# EAGLE design piezo-layer_v0.3-R001 (EAGLE 6.5.0)
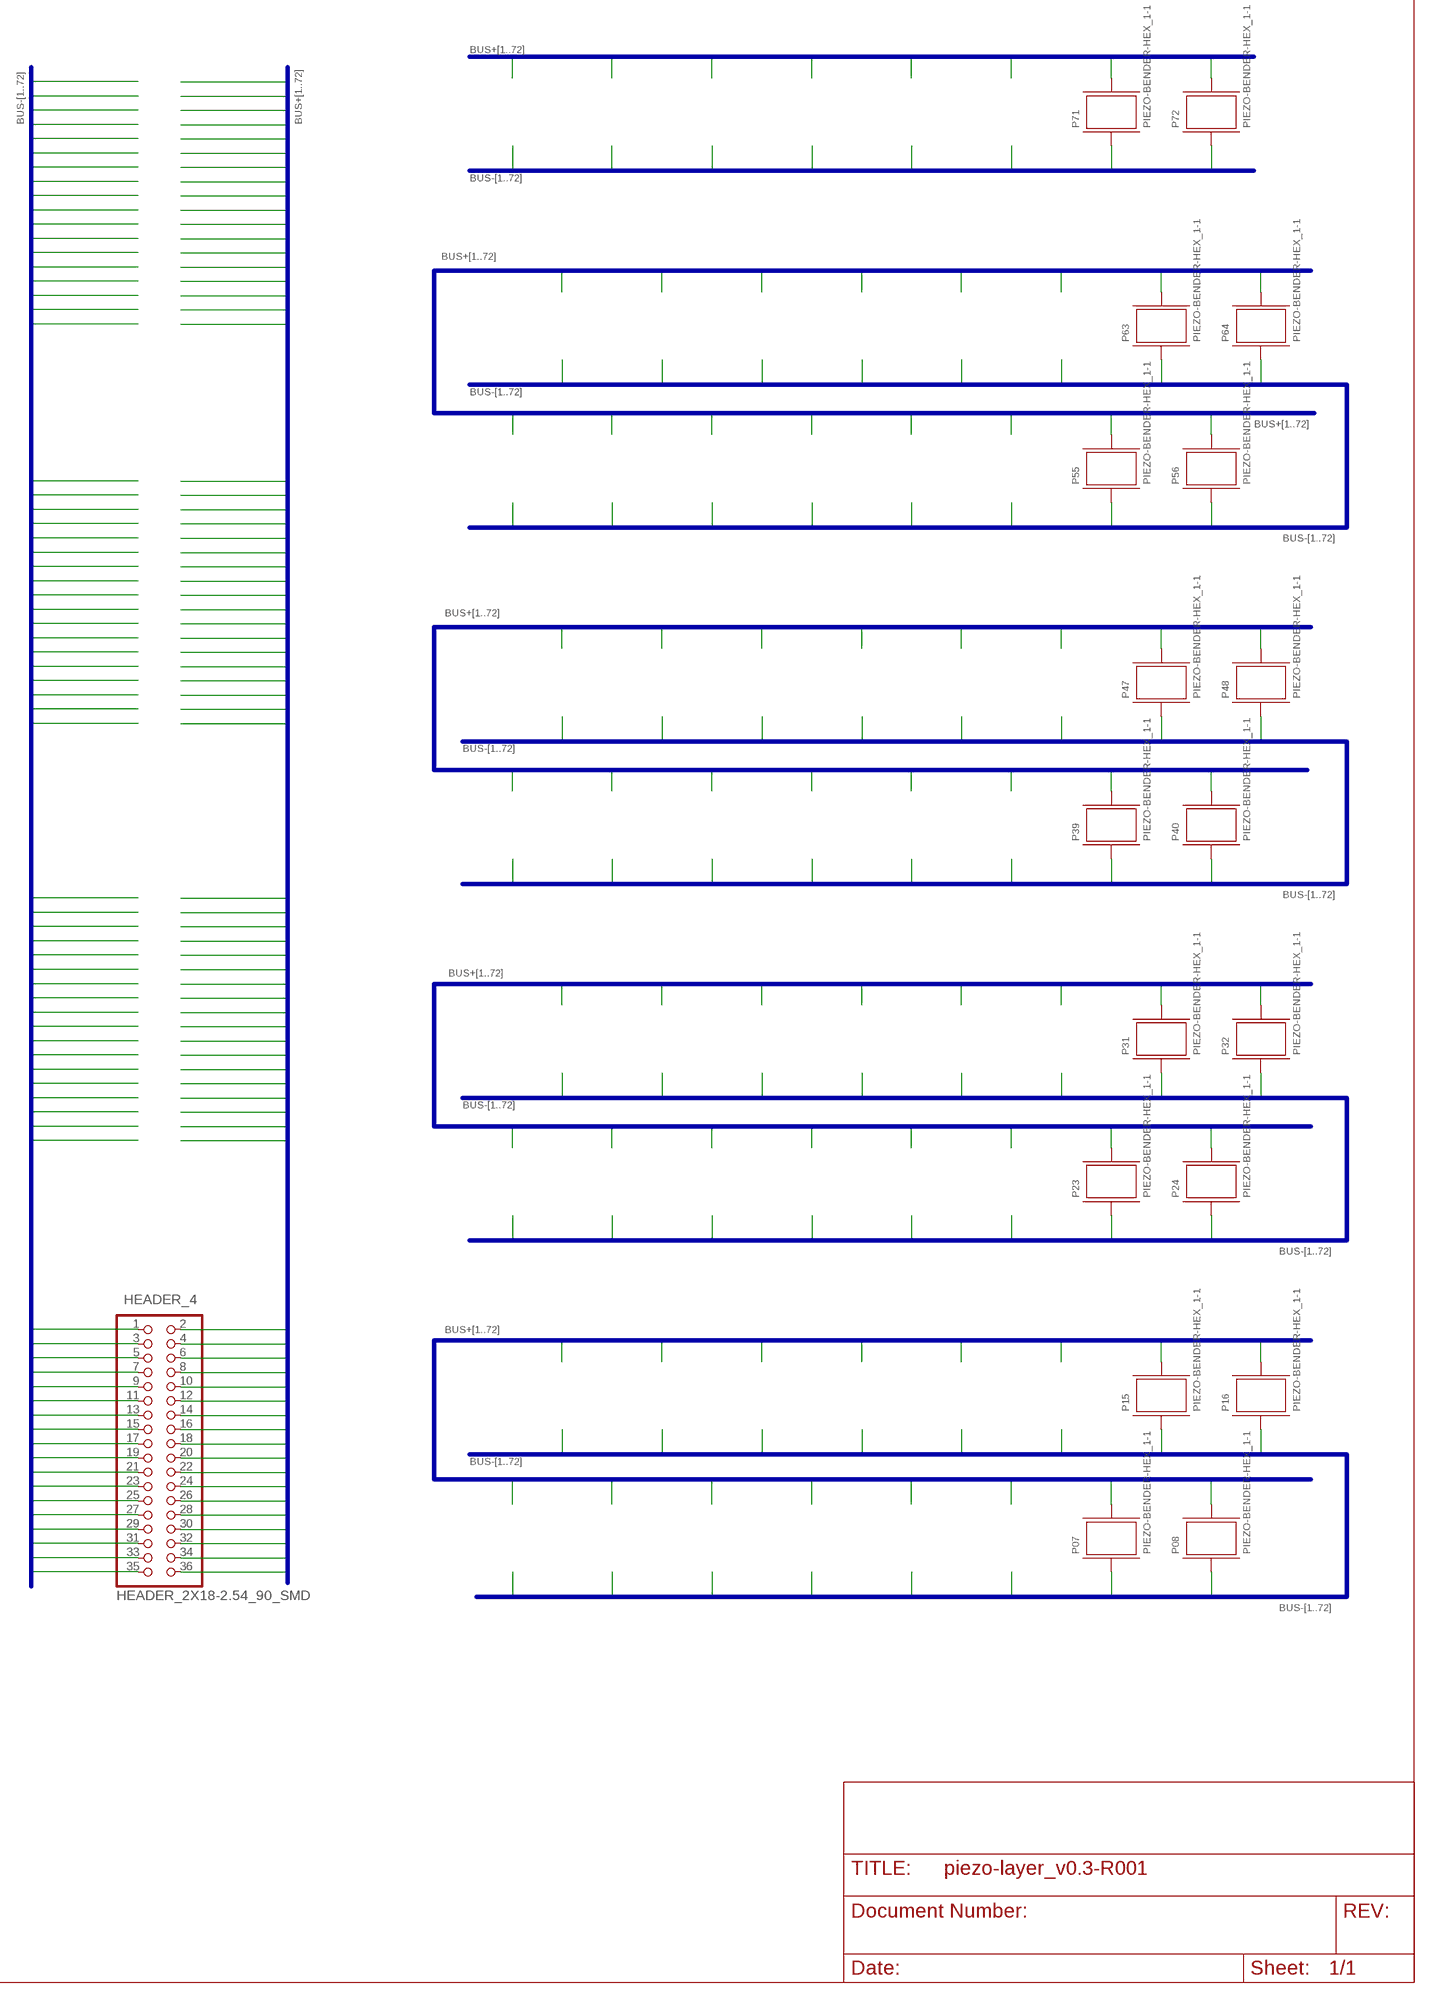
[diagram p0: schematic, sheet 1]

## Parts
HEADER_4  HEADER_2X18-2.54_90_SMD  [2X18_2.54_90_SMD]
P07  PIEZO-BENDER-HEX_1-1  [PIEZO-BENDER-HEX_16MM_1+_1-]
P08  PIEZO-BENDER-HEX_1-1  [PIEZO-BENDER-HEX_16MM_1+_1-]
P15  PIEZO-BENDER-HEX_1-1  [PIEZO-BENDER-HEX_16MM_1+_1-]
P16  PIEZO-BENDER-HEX_1-1  [PIEZO-BENDER-HEX_16MM_1+_1-]
P23  PIEZO-BENDER-HEX_1-1  [PIEZO-BENDER-HEX_16MM_1+_1-]
P24  PIEZO-BENDER-HEX_1-1  [PIEZO-BENDER-HEX_16MM_1+_1-]
P31  PIEZO-BENDER-HEX_1-1  [PIEZO-BENDER-HEX_16MM_1+_1-]
P32  PIEZO-BENDER-HEX_1-1  [PIEZO-BENDER-HEX_16MM_1+_1-]
P39  PIEZO-BENDER-HEX_1-1  [PIEZO-BENDER-HEX_16MM_1+_1-]
P40  PIEZO-BENDER-HEX_1-1  [PIEZO-BENDER-HEX_16MM_1+_1-]
P47  PIEZO-BENDER-HEX_1-1  [PIEZO-BENDER-HEX_16MM_1+_1-]
P48  PIEZO-BENDER-HEX_1-1  [PIEZO-BENDER-HEX_16MM_1+_1-]
P55  PIEZO-BENDER-HEX_1-1  [PIEZO-BENDER-HEX_16MM_1+_1-]
P56  PIEZO-BENDER-HEX_1-1  [PIEZO-BENDER-HEX_16MM_1+_1-]
P63  PIEZO-BENDER-HEX_1-1  [PIEZO-BENDER-HEX_16MM_1+_1-]
P64  PIEZO-BENDER-HEX_1-1  [PIEZO-BENDER-HEX_16MM_1+_1-]
P71  PIEZO-BENDER-HEX_1-1  [PIEZO-BENDER-HEX_16MM_1+_1-]
P72  PIEZO-BENDER-HEX_1-1  [PIEZO-BENDER-HEX_16MM_1+_1-]

## Nets
BUS+7: HEADER_4.18 P07.TIP1(+_1)
BUS+8: HEADER_4.36 P08.TIP1(+_1)
BUS+15: HEADER_4.16 P15.TIP1(+_1)
BUS+16: HEADER_4.34 P16.TIP1(+_1)
BUS+23: HEADER_4.14 P23.TIP1(+_1)
BUS+24: HEADER_4.32 P24.TIP1(+_1)
BUS+31: HEADER_4.12 P31.TIP1(+_1)
BUS+32: HEADER_4.30 P32.TIP1(+_1)
BUS+39: HEADER_4.10 P39.TIP1(+_1)
BUS+40: HEADER_4.28 P40.TIP1(+_1)
BUS+47: HEADER_4.8 P47.TIP1(+_1)
BUS+48: HEADER_4.26 P48.TIP1(+_1)
BUS+55: HEADER_4.6 P55.TIP1(+_1)
BUS+56: HEADER_4.24 P56.TIP1(+_1)
BUS+63: HEADER_4.4 P63.TIP1(+_1)
BUS+64: HEADER_4.22 P64.TIP1(+_1)
BUS+71: HEADER_4.2 P71.TIP1(+_1)
BUS+72: HEADER_4.20 P72.TIP1(+_1)
BUS-7: HEADER_4.17 P07.PAD1(-_1)
BUS-8: HEADER_4.35 P08.PAD1(-_1)
BUS-15: HEADER_4.15 P15.PAD1(-_1)
BUS-16: HEADER_4.33 P16.PAD1(-_1)
BUS-23: HEADER_4.13 P23.PAD1(-_1)
BUS-24: HEADER_4.31 P24.PAD1(-_1)
BUS-31: HEADER_4.11 P31.PAD1(-_1)
BUS-32: HEADER_4.29 P32.PAD1(-_1)
BUS-39: HEADER_4.9 P39.PAD1(-_1)
BUS-40: HEADER_4.27 P40.PAD1(-_1)
BUS-47: HEADER_4.7 P47.PAD1(-_1)
BUS-48: HEADER_4.25 P48.PAD1(-_1)
BUS-55: HEADER_4.5 P55.PAD1(-_1)
BUS-56: HEADER_4.23 P56.PAD1(-_1)
BUS-63: HEADER_4.3 P63.PAD1(-_1)
BUS-64: HEADER_4.21 P64.PAD1(-_1)
BUS-71: HEADER_4.1 P71.PAD1(-_1)
BUS-72: HEADER_4.19 P72.PAD1(-_1)

## Buses
BUS+[1..72]
BUS-[1..72]

## Library data of the parts
HEADER_4 = SABRe:HEADER_2X18
P07 P08 P15 P16 P23 P24 P31 P32 P39 P40 P47 P48 P55 P56 P63 P64 P71 P72 = ICST:PIEZO-BENDER-HEX_1-1

## Board
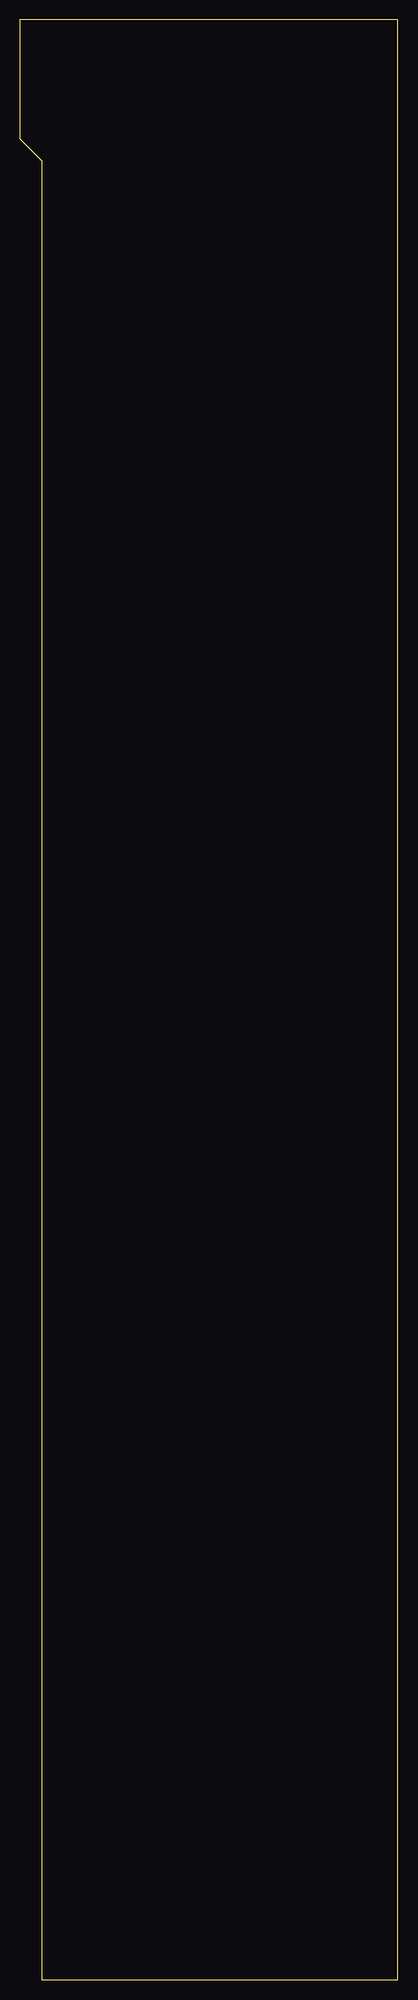
[diagram p1: board, top side]
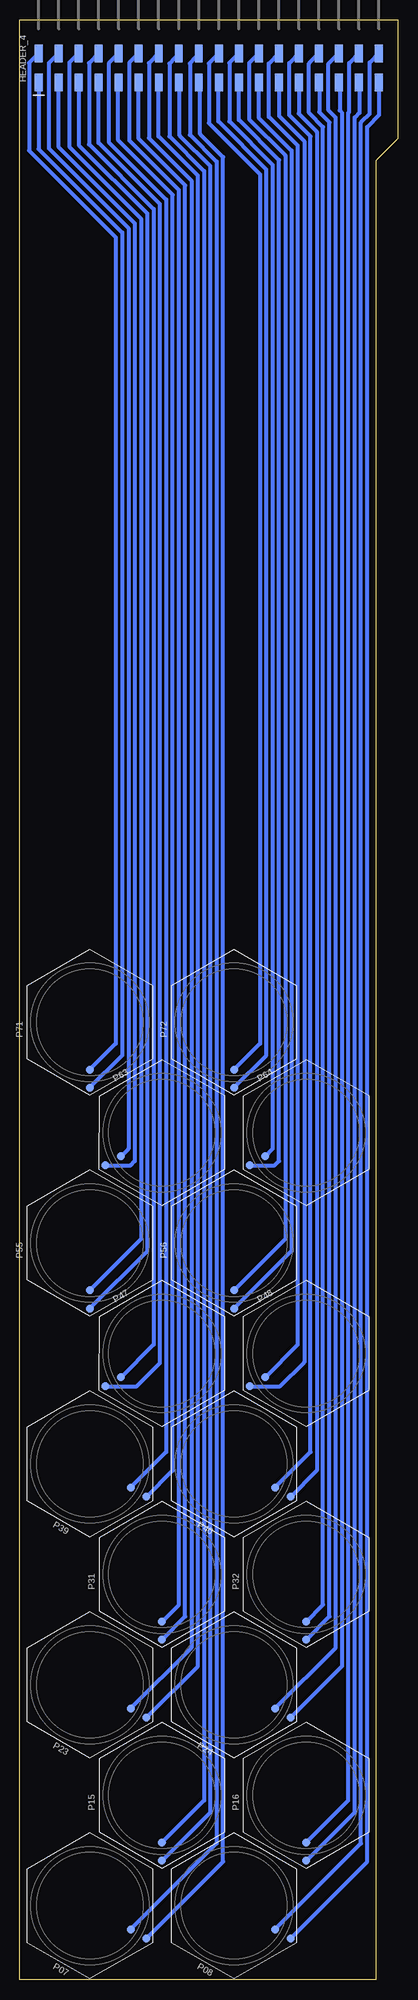
[diagram p2: board, bottom side, seen from below]

Size 48 x 248.5 mm. Coordinates in mm from the lower left corner, seen from the top.
Outline: 2.8,0 48,0 48,248.5 0,248.5 0,233.4 2.8,230.6 2.8,0
Copper layers (1*16): Top 0.009mm / dielectric 0.2mm / Bottom 0.018mm
Design rules "1L-0.2-0.15_0.3mm *": minimum track width 0.2mm, minimum drill 0.3mm, track to track 0.15mm, track to pad 0.15mm, pad to pad 0.15mm, via to via 0.15mm, smd to smd 0.15mm, copper to edge 0.5mm, drill to drill 1mm, minimum pad ring 10mil, minimum via ring 8mil, stop-mask expansion 4mil, vias tented up to drill 0mil, thermal gap 10mil

### Footprints (pad centres in the part's own frame; a part is rotated, then mirrored left to right if it is on the bottom)
2X18_2.54_90_SMD = smd 1 x 2.2: 1 -21.59,-1.84; 2 -21.59,1.84; 3 -19.05,-1.84; 4 -19.05,1.84; 5 -16.51,-1.84; 6 -16.51,1.84; 7 -13.97,-1.84; 8 -13.97,1.84; 9 -11.43,-1.84; 10 -11.43,1.84; 11 -8.89,-1.84; 12 -8.89,1.84; 13 -6.35,-1.84; 14 -6.35,1.84; 15 -3.81,-1.84; 16 -3.81,1.84; 17 -1.27,-1.84; 18 -1.27,1.84; 19 1.27,-1.84; 20 1.27,1.84; 21 3.81,-1.84; 22 3.81,1.84; 23 6.35,-1.84; 24 6.35,1.84; 25 8.89,-1.84; 26 8.89,1.84; 27 11.43,-1.84; 28 11.43,1.84; 29 13.97,-1.84; 30 13.97,1.84; 31 16.51,-1.84; 32 16.51,1.84; 33 19.05,-1.84; 34 19.05,1.84; 35 21.59,-1.84; 36 21.59,1.84
PIEZO-BENDER-HEX_16MM_1+_1- = smd 1 x 1: PAD1 -8.3,0; TIP1 -6,0

### Placement (x,y rotation side)
HEADER_4  24,242.4 0 bottom
P07  39.1,9.4 150 bottom
P08  20.8,9.4 150 bottom
P15  29.95,23.4 90 bottom
P16  11.65,23.4 90 bottom
P23  39.1,37.4 150 bottom
P24  20.8,37.4 150 bottom
P31  29.95,51.4 90 bottom
P32  11.65,51.4 90 bottom
P39  39.1,65.4 150 bottom
P40  20.8,65.4 150 bottom
P47  29.95,79.4 30 bottom
P48  11.65,79.4 30 bottom
P55  39.1,93.4 90 bottom
P56  20.8,93.4 90 bottom
P63  29.95,107.4 30 bottom
P64  11.65,107.4 30 bottom
P71  39.1,121.4 90 bottom
P72  20.8,121.4 90 bottom

### Tracks (layer width: path | path; a pad name or v marks a point on that pad's centre or on a via)
BUS+7
  Bottom 0.5: P07.TIP1 23,17.3 23,230.5 26.4,233.9 26.4,242.98 HEADER_4.18
BUS+8
  Bottom 0.5: P08.TIP1 4.7,17.3 4.7,235.5 3.6,236.6 3.6,243.05 HEADER_4.36
BUS+15
  Bottom 0.5: P15.TIP1 24.6,22.75 24.6,229.3 29,233.7 29,242.92 HEADER_4.16
BUS+16
  Bottom 0.5: P16.TIP1 6.3,22.75 6.3,236.7 6.2,236.8 6.2,242.99 HEADER_4.34
BUS+23
  Bottom 0.5: P23.TIP1 26.2,42.1 26.2,228.1 31.6,233.5 31.6,242.99 HEADER_4.14
BUS+24
  Bottom 0.5: P24.TIP1 7.9,42.1 7.9,236.1 8.8,237 8.8,242.93 HEADER_4.32
BUS+31
  Bottom 0.5: P31.TIP1 27.8,47.55 27.8,226.9 34.1,233.2 34.1,243.03 HEADER_4.12
BUS+32
  Bottom 0.5: P32.TIP1 9.5,47.55 9.5,234.9 11.3,236.7 11.3,242.97 HEADER_4.30
BUS+39
  Bottom 0.5: P39.TIP1 29.4,66.9 29.4,225.7 36.7,233 36.7,242.97 HEADER_4.10
BUS+40
  Bottom 0.5: P40.TIP1 11.1,66.9 11.1,233.7 13.8,236.4 13.8,243.01 HEADER_4.28
BUS+47
  Bottom 0.5: P47.TIP1 31,80.55 31,224.5 39.2,232.7 39.2,243.01 HEADER_4.8
BUS+48
  Bottom 0.5: P48.TIP1 12.7,80.55 12.7,232.5 16.4,236.2 16.4,242.95 HEADER_4.26
BUS+55
  Bottom 0.5: P55.TIP1 32.6,93.9 32.6,223.3 41.7,232.4 41.7,243.05 HEADER_4.6
BUS+56
  Bottom 0.5: P56.TIP1 14.3,93.9 14.3,231.3 18.9,235.9 18.9,242.99 HEADER_4.24
BUS+63
  Bottom 0.5: P63.TIP1 34.2,105.35 34.2,222.1 44.3,232.2 44.3,242.99 HEADER_4.4
BUS+64
  Bottom 0.5: P64.TIP1 15.9,105.35 15.9,230.1 21.4,235.6 21.4,243.03 HEADER_4.22
BUS+71
  Bottom 0.5: P71.TIP1 35.8,118.7 35.8,220.9 46.8,231.9 46.8,243.03 HEADER_4.2
BUS+72
  Bottom 0.5: P72.TIP1 17.5,118.7 17.5,228.9 24,235.4 24,242.97 HEADER_4.20
BUS-7
  Bottom 0.5: P07.PAD1 22.2,14.96 22.2,231.1 25.1,234 25.1,240.52 HEADER_4.17
BUS-8
  Bottom 0.5: P08.PAD1 3.9,14.96 3.9,234.9 2.4,236.4 HEADER_4.35
BUS-15
  Bottom 0.5: P15.PAD1 23.8,21.25 23.8,229.9 27.7,233.8 27.7,240.54 HEADER_4.15
BUS-16
  Bottom 0.5: P16.PAD1 5.5,21.25 5.5,236.1 4.9,236.7 4.9,240.51 HEADER_4.33
BUS-23
  Bottom 0.5: P23.PAD1 25.4,39.76 25.4,228.7 30.4,233.7 30.4,240.51 HEADER_4.13
BUS-24
  Bottom 0.5: P24.PAD1 7.1,39.76 7.1,236.7 7.4,237 7.4,240.47 HEADER_4.31
BUS-31
  Bottom 0.5: P31.PAD1 27,46.05 27,227.5 32.9,233.4 HEADER_4.11
BUS-32
  Bottom 0.5: P32.PAD1 8.7,46.05 8.7,235.5 10,236.8 10,240.53 HEADER_4.29
BUS-39
  Bottom 0.5: P39.PAD1 28.6,64.56 28.6,226.3 35.5,233.2 35.5,240.49 HEADER_4.9
BUS-40
  Bottom 0.5: P40.PAD1 10.3,64.56 10.3,234.3 12.6,236.6 12.6,240.53 HEADER_4.27
BUS-47
  Bottom 0.5: P47.PAD1 33.15,75.25 30.2,78.2 30.2,225.1 38,232.9 38,240.53 HEADER_4.7
BUS-48
  Bottom 0.5: P48.PAD1 14.95,75.25 11.9,78.3 11.9,233.1 15.1,236.3 HEADER_4.25
BUS-55
  Bottom 0.5: P55.PAD1 31.8,92.4 31.8,223.9 40.5,232.6 HEADER_4.5
BUS-56
  Bottom 0.5: P56.PAD1 13.5,92.4 13.5,231.9 17.7,236.1 17.7,240.51 HEADER_4.23
BUS-63
  Bottom 0.5: P63.PAD1 33.95,103.25 33.4,103.8 33.4,222.7 43.1,232.4 43.1,240.51 HEADER_4.3
BUS-64
  Bottom 0.5: P64.PAD1 15.65,103.25 15.1,103.8 15.1,230.7 20.2,235.8 HEADER_4.21
BUS-71
  Bottom 0.5: P71.PAD1 35,117.2 35,221.5 45.6,232.1 HEADER_4.1
BUS-72
  Bottom 0.5: P72.PAD1 16.7,117.2 16.7,229.5 22.8,235.6 22.8,240.49 HEADER_4.19